# EAGLE design board (EAGLE 5.11)
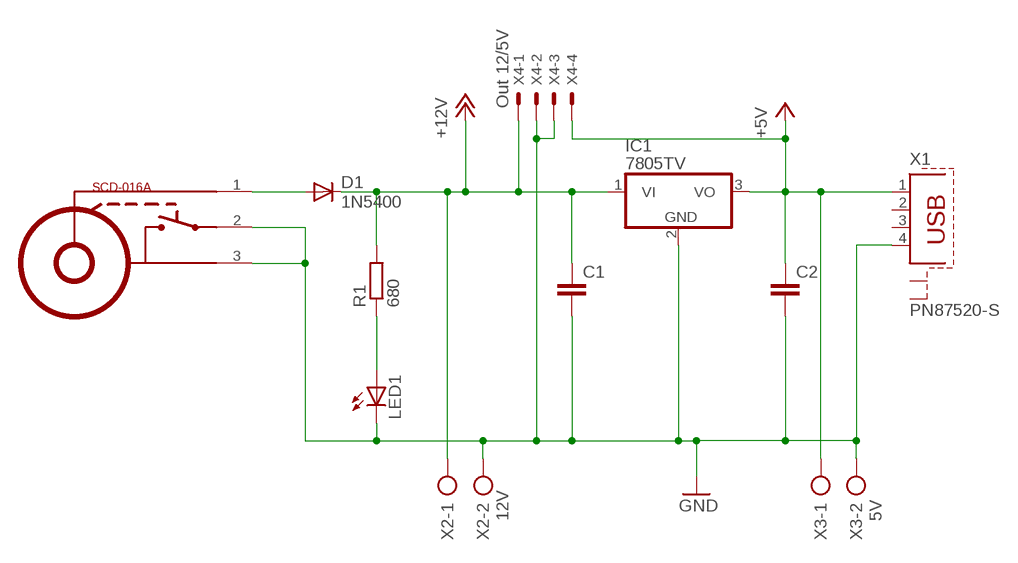
[diagram p0: schematic, sheet 1]

## Parts
C1  C-EU025-025X050  [C025-025X050]
C2  C-EU025-025X050  [C025-025X050]
D1  1N5400  [DO201-15]
IC1  7805TV  [TO220V]
LED1  LED3MM  [LED3MM]
POWER2  NAPAJECI_KONEKTOR_SCD-016A  [NAPAJECI_KONEKTOR_SCD-016A]
R1  680  R-EU_0207/10  [0207/10]
X1  PN87520-S  [PN87520-S]
X2  12V  AK500/2  [AK500/2]
X3  5V  AK500/2  [AK500/2]
X4  Out 12/5V  22-23-2041  [22-23-2041]

## Nets
+5V: C2.1 IC1.3(VO) X1.1 X3.1 X4.4
+12V: C1.1 D1.C IC1.1(VI) R1.2 X2.1 X4.1
GND: C1.2 C2.2 IC1.2(GND) LED1.K(C) POWER2.2 POWER2.3(PROSTREDEK) X1.4 X2.2 X3.2 X4.2 X4.3
N$1: D1.A POWER2.1(OBAL)
N$3: LED1.A R1.1
Unconnected: X1.2 X1.3 X1.S1 X1.S2

## Library data of the parts
C1 C2 = resistor:C-EU: CAPACITOR, European symbol
D1 = diode:1N5400: DIODE standard rectifier, 3 A, 50 V (Motorola)
IC1 = linear:78*: Positive VOLTAGE REGULATOR Source: http://cache.national.com/ds/LM/LM78L05.pdf http://www.fairchildsemi.com/ds/LM/LM7805.pdf
LED1 = led:LED: LED OSRAM: - CHIPLED LG R971, LG N971, LY N971, LG Q971, LY Q971, LO R971, LY R971 LH N974, LH R974 LS Q976, LO Q976, LY Q976 LO Q996 - Hyper CHIPLED LW Q18S LB Q993, LB Q99A, LB R99A - SideLED LS A670, LO A670, LY A670, LG A670, LP A670 LB A673, LV A673, LT A673, LW A673 LH A674 LY A675 LS A676, LA A676, LO A676, LY A676, LW A676 LS A679, LY A679, LG A679 - Hyper Micro SIDELED® LS Y876, LA Y876, LO Y876, LY Y876 LT Y87S - SmartLED LW L88C, LW L88S LB L89C, LB L89S, LG L890 LS L89K, LO L89K, LY L89K LS L896, LA L896, LO L896, LY L896 - TOPLED LS T670, LO T670, LY T670, LG T670, LP T670 LSG T670, LSP T670, LSY T670, LOP T670, LYG T670 LG T671, LOG T671, LSG T671 LB T673, LV T673, LT T673, LW T673 LH T674 LS T676, LA T676, LO T676, LY T676, LB T676, LH T676, LSB T676, LW T676 LB T67C, LV T67C, LT T67C, LS T67K, LO T67K, LY T67K, LW E67C LS E67B, LA E67B, LO E67B, LY E67B, LB E67C, LV E67C, LT E67C LW T67C LS T679, LY T679, LG T679 LS T770, LO T770, LY T770, LG T770, LP T770 LB T773, LV T773, LT T773, LW T773 LH T774 LS E675, LA E675, LY E675, LS T675 LS T776, LA T776, LO T776, LY T776, LB T776 LHGB T686 LT T68C, LB T68C - Hyper Mini TOPLED® LB M676 - Mini TOPLED Santana® LG M470 LS M47K, LO M47K, LY M47K Source: http://www.osram.convergy.de LUXEON: - LUMILED® LXK2-PW12-R00, LXK2-PW12-S00, LXK2-PW14-U00, LXK2-PW14-V00 LXK2-PM12-R00, LXK2-PM12-S00, LXK2-PM14-U00 LXK2-PE12-Q00, LXK2-PE12-R00, LXK2-PE12-S00, LXK2-PE14-T00, LXK2-PE14-U00 LXK2-PB12-K00, LXK2-PB12-L00, LXK2-PB12-M00, LXK2-PB14-N00, LXK2-PB14-P00, LXK2-PB14-Q00 LXK2-PR12-L00, LXK2-PR12-M00, LXK2-PR14-Q00, LXK2-PR14-R00 LXK2-PD12-Q00, LXK2-PD12-R00, LXK2-PD12-S00 LXK2-PH12-R00, LXK2-PH12-S00 LXK2-PL12-P00, LXK2-PL12-Q00, LXK2-PL12-R00 Source: www.luxeon.com KINGBRIGHT: KA-3528ASYC Source: www.kingbright.com
POWER2 = #hacesoft:NAPAJECI_KONEKTOR_SCD-016A
R1 = rcl:R-EU_: RESISTOR, European symbol
X1 = con-berg:PN87520-S; OC_FARNELL: unknown; OC_NEWARK: unknown
X2 X3 = con-ptr500:AK500/2: CONNECTOR; OC_FARNELL: unknown; OC_NEWARK: unknown
X4 = con-molex:22-23-2041: .100" (2.54mm) Center Header - 4 Pin; MF: MOLEX; MPN: 22-23-2041; OC_FARNELL: 1462920; OC_NEWARK: 38C0355

## Board
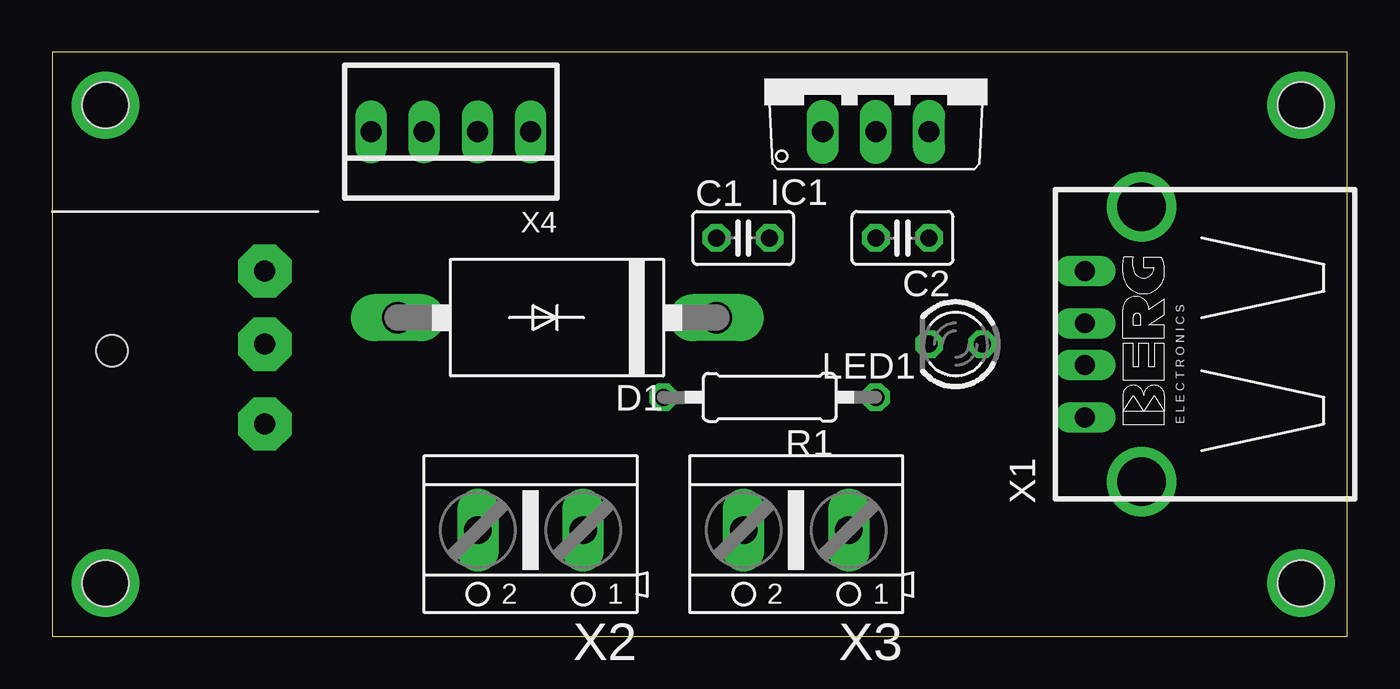
[diagram p1: board, top side]
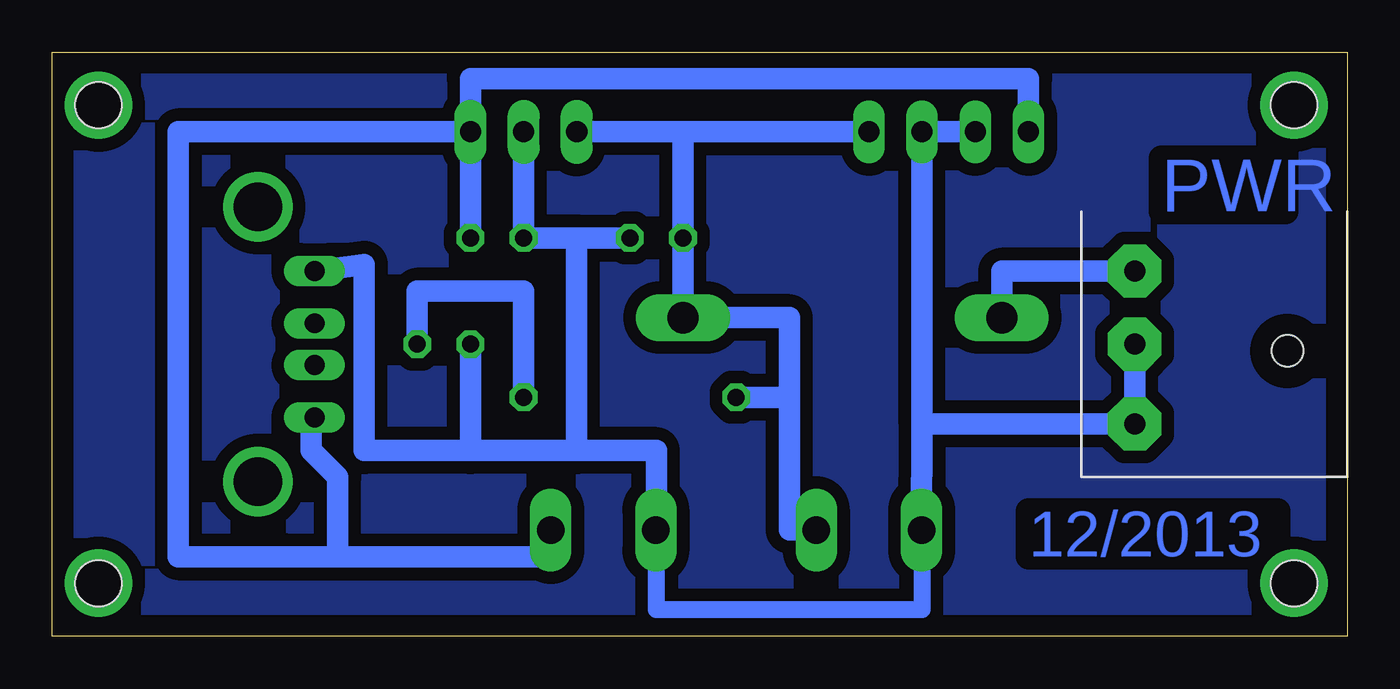
[diagram p2: board, bottom side, seen from below]

Size 61.9 x 27.93 mm. Coordinates in mm from the lower left corner, seen from the top.
Outline: 0,0 61.9,0 61.9,27.93 0,27.93 0,0
Copper layers (1*16): Top 0.035mm / dielectric 1.5mm / Bottom 0.035mm
Design rules "default": minimum track width 10mil, minimum drill 24mil, track to track 8mil, track to pad 8mil, pad to pad 8mil, via to via 8mil, smd to smd 8mil, copper to edge 40mil, drill to drill 8mil, minimum pad ring 10mil, minimum via ring 8mil, stop-mask expansion 4mil, vias tented up to drill 0mil, thermal gap 10mil
Holes 2.2 mm at 2.54,25.4 2.54,2.54 59.69,25.4 59.69,2.54

### Footprints (pad centres in the part's own frame; a part is rotated, then mirrored left to right if it is on the bottom)
C025-025X050 = drill 0.813 octagon: 1 -1.27,0; 2 1.27,0
DO201-15 = drill 1.499 long: A 7.62,0; C -7.62,0
TO220V = drill 1.016 long: 1 -2.54,-2.54; 2 0,-2.54; 3 2.54,-2.54
LED3MM = drill 0.813 octagon: A -1.27,0; K 1.27,0
NAPAJECI_KONEKTOR_SCD-016A = drill 1 pad 2.54 octagon: 1 0,7.303; 2 0,3.81; 3 0,0 | hole 1.5: -7.303,3.493
0207/10 = drill 0.813 octagon: 1 -5.08,0; 2 5.08,0
PN87520-S = drill 0.95 long: 1 -3.5,2.71; 2 -1,2.71; 3 1,2.71; 4 3.5,2.71 | drill 2.3 pad 2.9 round: S1 -6.57,0; S2 6.57,0
AK500/2 = drill 1.321 long: 1 -2.515,0; 2 2.515,0
22-23-2041 = drill 1 long: 1 -3.81,0; 2 -1.27,0; 3 1.27,0; 4 3.81,0

### Placement (x,y rotation side)
C1  33.02,19.05 0 top
C2  40.64,19.05 180 top
D1  24.13,15.24 180 top
IC1  39.37,26.67 0 top
LED1  43.18,13.97 180 top
POWER2  10.16,10.16 0 top
R1  34.29,11.43 180 top
X1  52.07,13.97 90 top
X2  22.86,5.08 180 top
X3  35.56,5.08 180 top
X4  19.05,24.13 180 top

### Tracks (layer width: path | path; a pad name or v marks a point on that pad's centre or on a via)
+5V
  Bottom 0.406: 38.1,3.81 38.08,3.81
  Bottom 1.016: IC1.3 C2.1 | 48.26,3.81 50.8,3.81 55.88,3.81 55.88,24.13 IC1.3 | X4.4 15.24,26.67 41.91,26.67 IC1.3 | 48.26,3.81 38.1,3.81 | 38.08,3.81 X3.1 | X1.1 49.53,10.47 49.53,8.89 48.26,7.62 48.26,3.81
+12V
  Bottom 0.406: 30.48,15.24 D1.C
  Bottom 1.016: 31.75,24.13 X4.1 | 31.75,24.13 IC1.1 | X2.1 26.67,5.08 26.67,11.43 | 26.67,11.43 26.67,15.24 30.48,15.24 | 26.67,11.43 R1.2 | D1.C C1.1 31.75,24.13
GND
  Bottom 0.406: X3.2 33.02,3.81
  Bottom 0.813: X2.2 20.32,1.27 33.02,1.27 X3.2
  Bottom 1.016: X1.4 46.99,17.78 46.99,8.89 41.91,8.89 | 41.91,8.89 LED1.K | IC1.2 C2.2 36.83,19.05 | 36.83,19.05 C1.2 | X4.3 X4.2 20.32,10.16 | 33.02,3.81 33.02,8.89 36.83,8.89 | 36.83,8.89 41.91,8.89 | POWER2.2 POWER2.3 20.32,10.16 | 20.32,10.16 X2.2 | 36.83,8.89 36.83,19.05
N$1
  Bottom 1.016: POWER2.1 16.51,17.46 D1.A
N$2
  pour Bottom (isolate 0.61): 0,27.94 0,0 62.23,0 62.23,27.94
N$3
  Bottom 1.016: R1.1 39.37,16.51 44.45,16.51 LED1.A
N$4  (via drill 2.2)
  other vias: 2.54,25.4
N$5  (via drill 2.2)
  other vias: 2.54,2.54
N$6  (via drill 2.2)
  other vias: 59.69,25.4
N$7  (via drill 2.2)
  other vias: 59.69,2.54

### Text on the board
Bottom: PWR | 12/2013